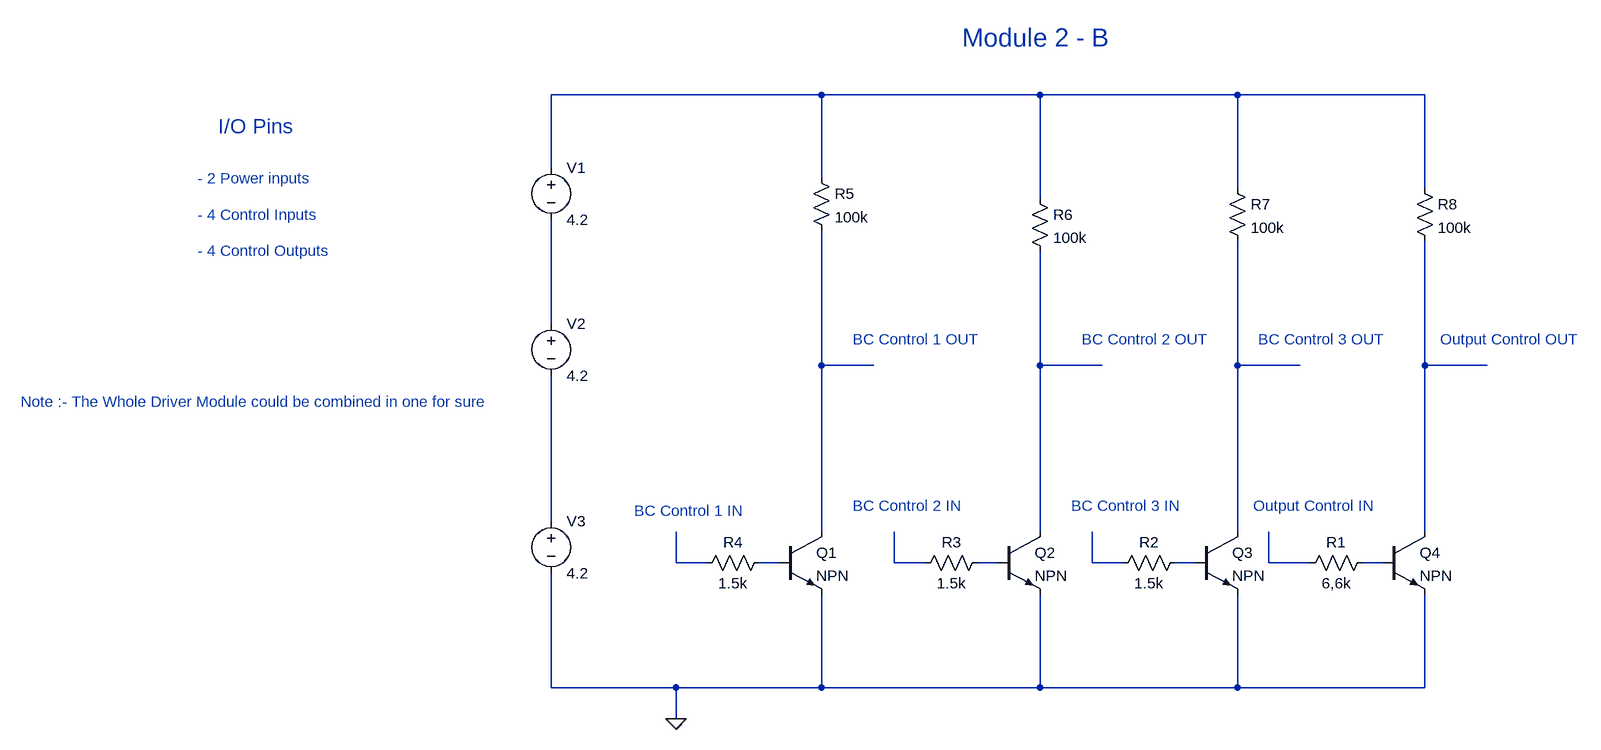
[diagram p0: schematic Module 2 - B(Driver 2).asc]
Module 2 - B(Driver 2).asc, the LTspice schematic file:
Version 4
SHEET 1 1744 884
WIRE 560 -96 144 -96
WIRE 896 -96 560 -96
WIRE 1200 -96 896 -96
WIRE 1488 -96 1200 -96
WIRE 144 16 144 -96
WIRE 560 32 560 -96
WIRE 1200 48 1200 -96
WIRE 1488 48 1488 -96
WIRE 896 64 896 -96
WIRE 144 256 144 96
WIRE 560 320 560 112
WIRE 640 320 560 320
WIRE 896 320 896 144
WIRE 992 320 896 320
WIRE 1200 320 1200 128
WIRE 1296 320 1200 320
WIRE 1488 320 1488 128
WIRE 1584 320 1488 320
WIRE 144 560 144 336
WIRE 560 576 560 320
WIRE 896 576 896 320
WIRE 1200 576 1200 320
WIRE 1488 576 1488 320
WIRE 336 624 336 576
WIRE 384 624 336 624
WIRE 496 624 464 624
WIRE 672 624 672 576
WIRE 720 624 672 624
WIRE 832 624 800 624
WIRE 976 624 976 576
WIRE 1024 624 976 624
WIRE 1136 624 1104 624
WIRE 1248 624 1248 576
WIRE 1312 624 1248 624
WIRE 1424 624 1392 624
WIRE 144 816 144 640
WIRE 336 816 144 816
WIRE 560 816 560 672
WIRE 560 816 336 816
WIRE 896 816 896 672
WIRE 896 816 560 816
WIRE 1200 816 1200 672
WIRE 1200 816 896 816
WIRE 1488 816 1488 672
WIRE 1488 816 1200 816
WIRE 336 864 336 816
FLAG 336 864 0
SYMBOL voltage 144 0 R0
WINDOW 123 0 0 Left 0
WINDOW 39 0 0 Left 0
SYMATTR InstName V1
SYMATTR Value 4.2
SYMBOL voltage 144 240 R0
WINDOW 123 0 0 Left 0
WINDOW 39 0 0 Left 0
SYMATTR InstName V2
SYMATTR Value 4.2
SYMBOL voltage 144 544 R0
WINDOW 123 0 0 Left 0
WINDOW 39 0 0 Left 0
SYMATTR InstName V3
SYMATTR Value 4.2
SYMBOL npn 496 576 R0
SYMATTR InstName Q1
SYMBOL npn 832 576 R0
SYMATTR InstName Q2
SYMBOL npn 1136 576 R0
SYMATTR InstName Q3
SYMBOL npn 1424 576 R0
SYMATTR InstName Q4
SYMBOL res 1408 608 R90
WINDOW 0 0 56 VBottom 2
WINDOW 3 32 56 VTop 2
SYMATTR InstName R1
SYMATTR Value 6,6k
SYMBOL res 1120 608 R90
WINDOW 0 0 56 VBottom 2
WINDOW 3 32 56 VTop 2
SYMATTR InstName R2
SYMATTR Value 1.5k
SYMBOL res 816 608 R90
WINDOW 0 0 56 VBottom 2
WINDOW 3 32 56 VTop 2
SYMATTR InstName R3
SYMATTR Value 1.5k
SYMBOL res 480 608 R90
WINDOW 0 0 56 VBottom 2
WINDOW 3 32 56 VTop 2
SYMATTR InstName R4
SYMATTR Value 1.5k
SYMBOL res 544 16 R0
SYMATTR InstName R5
SYMATTR Value 100k
SYMBOL res 880 48 R0
SYMATTR InstName R6
SYMATTR Value 100k
SYMBOL res 1184 32 R0
SYMATTR InstName R7
SYMATTR Value 100k
SYMBOL res 1472 32 R0
SYMATTR InstName R8
SYMATTR Value 100k
TEXT 776 -184 Left 4 ;Module 2 - B
TEXT 272 544 Left 2 ;BC Control 1 IN
TEXT 608 536 Left 2 ;BC Control 2 IN
TEXT 944 536 Left 2 ;BC Control 3 IN
TEXT 1224 536 Left 2 ;Output Control IN
TEXT 608 280 Left 2 ;BC Control 1 OUT
TEXT 960 280 Left 2 ;BC Control 2 OUT
TEXT 1232 280 Left 2 ;BC Control 3 OUT
TEXT 1512 280 Left 2 ;Output Control OUT
TEXT -368 -48 Left 3 ;I/O Pins
TEXT -400 32 Left 2 ;- 2 Power inputs
TEXT -400 88 Left 2 ;- 4 Control Inputs
TEXT -400 144 Left 2 ;- 4 Control Outputs
TEXT -672 376 Left 2 ;Note :- The Whole Driver Module could be combined in one for sure

The netlist it stands for:
* Module 2 - B(Driver 2).asc
V1 N001 N002 4.2
V2 N002 N007 4.2
V3 N007 0 4.2
Q1 N003 N009 0 0 NPN
Q2 N004 N011 0 0 NPN
Q3 N005 N013 0 0 NPN
Q4 N006 N015 0 0 NPN
R1 N015 N014 6,6k
R2 N013 N012 1.5k
R3 N011 N010 1.5k
R4 N009 N008 1.5k
R5 N001 N003 100k
R6 N001 N004 100k
R7 N001 N005 100k
R8 N001 N006 100k
.model NPN NPN
.model PNP PNP
.lib standard.bjt
* Module 2 - B
* BC Control 1 IN
* BC Control 2 IN
* BC Control 3 IN
* Output Control IN
* BC Control 1 OUT
* BC Control 2 OUT
* BC Control 3 OUT
* Output Control OUT
* I/O Pins
* - 2 Power inputs
* - 4 Control Inputs
* - 4 Control Outputs
* Note :- The Whole Driver Module could be combined in one for sure
.backanno
.end